# Altium project 499H_VOL_DEV_V1.PrjPcb (part 2 of 2)

## Sheet 31_STM32.SchDoc
size A4; SheetNumber: 7; SheetTotal: 11
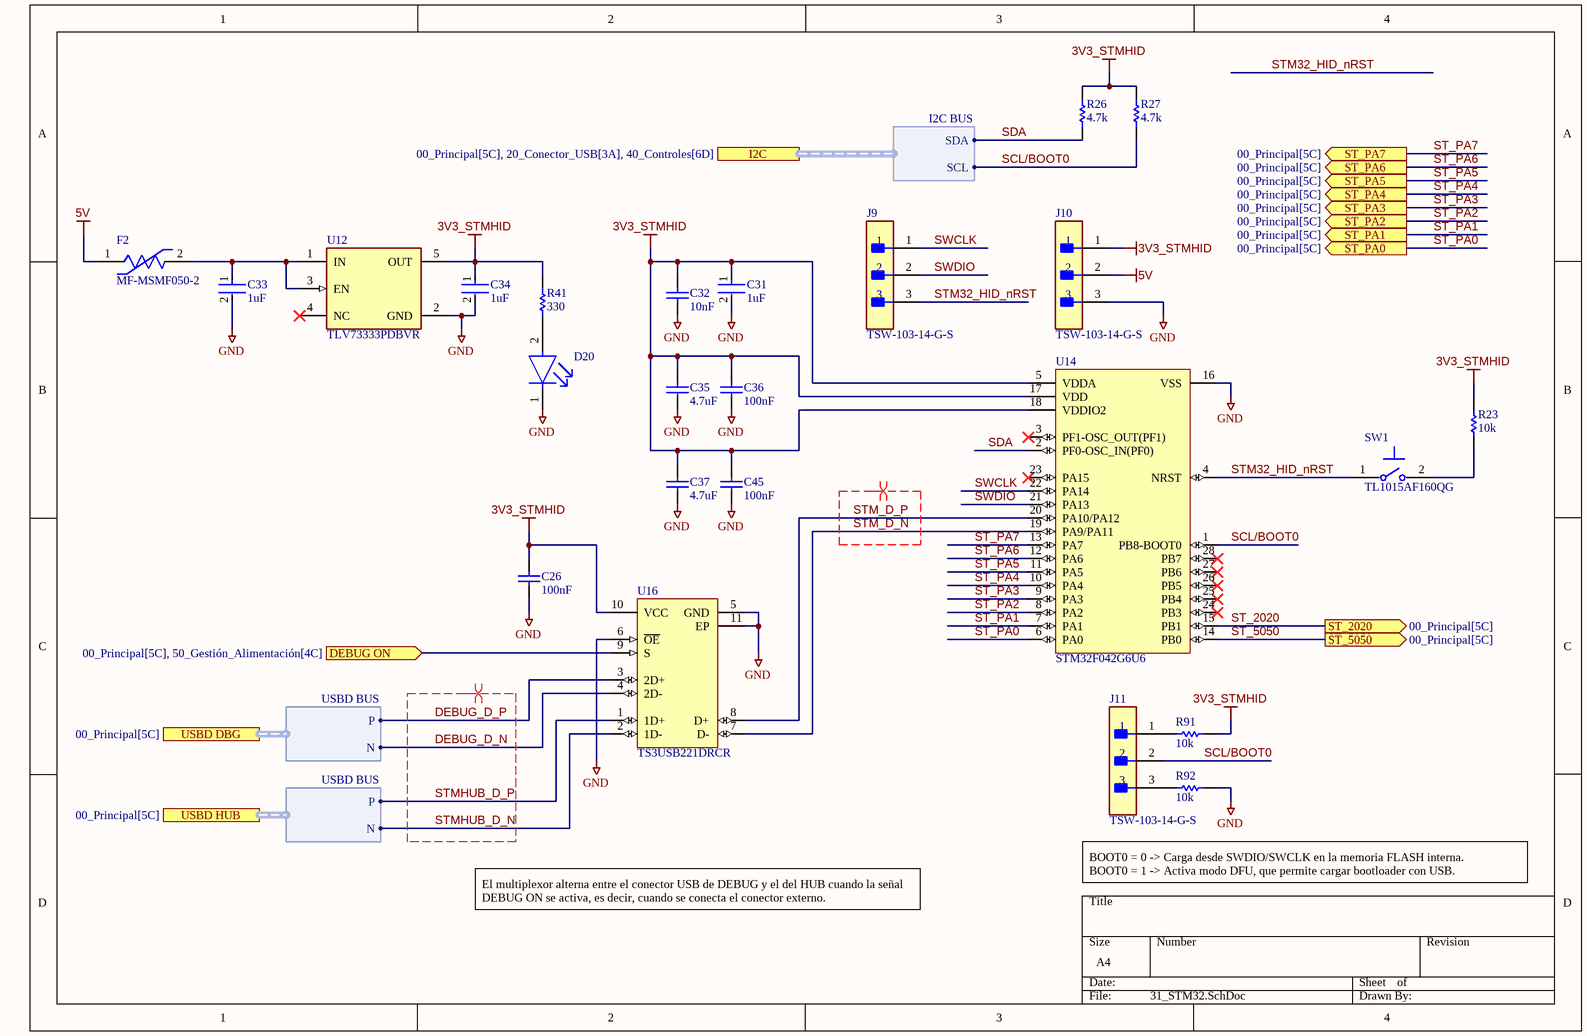
[diagram p6: 31_STM32.SchDoc]

### Parts
C26  100nF  [CAPC1005X55X25NL05T05]
C31  1uF  [FP-C0402C-BB-IPC_B]
C32  10nF  [CAPC1005X55X25ML05T05]
C33  1uF  [FP-C0402C-BB-IPC_B]
C34  1uF  [FP-C0402C-BB-IPC_B]
C35  4.7uF  [CAPC1005X71X25NL10T15]
C36  100nF  [CAPC1005X55X25NL05T05]
C37  4.7uF  [CAPC1005X71X25NL10T15]
C45  100nF  [CAPC1005X55X25NL05T05]
D20  APHD1608LZGCK  [FP-APHD1608LZGCK-MFG]  (value not drawn)
F2  MF-MSMF050-2  [FP-MF-MSMF050-2-MFG]
J9  TSW-103-14-G-S  [FP-TSW-103-14-G-S-MFG]
J10  TSW-103-14-G-S  [FP-TSW-103-14-G-S-MFG]
J11  TSW-103-14-G-S  [FP-TSW-103-14-G-S-MFG]
R23  10k  [RESC1005X40X25ML05T05]
R26  4.7k  [RESC1005X40X25ML05T10]
R27  4.7k  [RESC1005X40X25ML05T10]
R41  330  [RESC1005X40X25NL10T10]
R91  10k  [RESC1005X40X25ML05T05]
R92  10k  [RESC1005X40X25ML05T05]
SW1  TL1015AF160QG  [FP-TL1015AF160QG-MFG]
U12  TLV73333PDBVR  [FP-DBV0005A-MFG]
U14  STM32F042G6U6  [STM-UFQFPN28_V]
U16  TS3USB221DRCR  [DRC0010J_V]

### Ports
DEBUG ON (in, see 00_Principal[5C], 50_Gestión_Alimentación[4C]), I2C (harness I2C BUS, see 00_Principal[5C], 20_Conector_USB[3A], 40_Controles[6D]), ST_2020 (out, see 00_Principal[5C]), ST_5050 (out, see 00_Principal[5C]), ST_PA0 (out, see 00_Principal[5C]), ST_PA1 (out, see 00_Principal[5C]), ST_PA2 (out, see 00_Principal[5C]), ST_PA3 (out, see 00_Principal[5C]), ST_PA4 (out, see 00_Principal[5C]), ST_PA5 (out, see 00_Principal[5C]), ST_PA6 (out, see 00_Principal[5C]), ST_PA7 (out, see 00_Principal[5C]), USBD DBG (harness USBD BUS, see 00_Principal[5C]), USBD HUB (harness USBD BUS, see 00_Principal[5C])

### Harnesses
USBD BUS: P, N
I2C BUS: SDA, SCL

### Nets
3V3_STMHID: C26.2 C31.1 C32.2 C34.1 C35.2 C36.2 C37.2 C45.2 J10.1 R23.2 R26.2 R27.2 R41.2 R91.1 U12.5(OUT) U14.5(VDDA) U14.17(VDD) U14.18(VDDIO2) U16.10(VCC)
5V: F2.1 J10.2
GND: C26.1 C31.2 C32.1 C33.2 C34.2 C35.1 C36.1 C37.1 C45.1 D20.1(C) J10.3 R92.1 U12.2(GND) U14.16(VSS) U16.5(GND) U16.6(~{OE}) U16.11(EP)
DEBUG ON: U16.9(S) ; port DEBUG ON
DEBUG_D_N: U16.4(2D-)
DEBUG_D_P: U16.3(2D+) ; port USBD DBG.P
SCL/BOOT0: J11.2 R27.1 U14.1(PB8-BOOT0) ; port I2C.SCL  [project net SCL]
SDA: R26.1 U14.2(PF0-OSC_IN(PF0)) ; port I2C.SDA
ST_2020: U14.15(PB1) ; port ST_2020
ST_5050: U14.14(PB0) ; port ST_5050
ST_PA0: U14.6(PA0) ; port ST_PA0  [project net LRS PG]
ST_PA1: U14.7(PA1) ; port ST_PA1
ST_PA2: U14.8(PA2) ; port ST_PA2  [project net HUB_RESET]
ST_PA3: U14.9(PA3) ; port ST_PA3
ST_PA4: U14.10(PA4) ; port ST_PA4  [project net IMON]
ST_PA5: U14.11(PA5) ; port ST_PA5
ST_PA6: U14.12(PA6) ; port ST_PA6
ST_PA7: U14.13(PA7) ; port ST_PA7
STM32_HID_nRST: J9.3 SW1.1 U14.4(NRST)
STM_D_N: U14.19(PA9/PA11) U16.7(D-)
STM_D_P: U14.20(PA10/PA12) U16.8(D+)
STMHUB_D_N: U16.2(1D-)
STMHUB_D_P: U16.1(1D+) ; port USBD HUB.P
SWCLK: J9.1 U14.22(PA14)
SWDIO: J9.2 U14.21(PA13)
NetC33_1: C33.1 F2.2 U12.1(IN) U12.3(EN)
NetD20_2: D20.2(A) R41.1
NetJ11_1: J11.1 R91.2
NetJ11_3: J11.3 R92.2
NetR23_1: R23.1 SW1.2

Not connected (* = marked no-connect by the designer): U12 4(NC)*; U14 3(PF1-OSC_OUT(PF1))* 23(PA15)* 24(PB3)* 25(PB4)* 26(PB5)* 27(PB6)* 28(PB7)*

### Layout directives
differential pair; rule Differential Pairs Routing [Pref Gap = 5mil    Min Gap  = 5mil    Max Gap  = 5milPref Width = 8.655mil    Min Width  = 8.655mil    Max Width  = 8.655mil]: DEBUG_D_N, DEBUG_D_P, STM_D_N, STM_D_P, STMHUB_D_N, STMHUB_D_P

### Notes on the sheet
- El multiplexor alterna entre el conector USB de DEBUG y el del HUB cuando la señal DEBUG ON se activa, es decir, cuando se conecta el conector externo.
- BOOT0 = 0 -> Carga desde SWDIO/SWCLK en la memoria FLASH interna.
  BOOT0 = 1 -> Activa modo DFU, que permite cargar bootloader con USB.

### Library data of the parts
C26 C36 C45 = CMP-2008-02030-1: as C4 on sheet 20_Conector_USB
C31 C33 C34 = CMP-03020-034679-1: CAP CER 1UF 16V X5R 0402; Dielectric Material: Ceramic; Tolerance: 10%; RoHS Compliant: Yes; Voltage Rating (DC): 16V; Voltage Rating: 16V; Max Operating Temperature: 85°C; Packaging: Cut Tape; Width: 0.02inch; Dielectric: X5R; Lead Free: Lead Free; Min Operating Temperature: -55°C; Mount: Surface Mount; Case/Package: 0402; Thickness: 0.022inch; REACH SVHC: No SVHC; Length: 0.039inch; Case Code (Metric): 1005; Case Code (Imperial): 0402; Capacitance: 1uF
C32 = CMP-2008-02027-1: Part Number: VJ0402Y103KXJCW1BC; Manufacturer: Vitramon
C35 C37 = CMP-2008-02043-1: Part Number: 0402ZD475MAT2A; Manufacturer: AVX Interconnect / Elco
D20 = CMP-44529-000045-1: LED GREEN CLEAR 1608 SMD; Test Current: 2mA; Dominant Wavelength: 525nm; Lens Color: Colorless; Luminous Intensity: 180mcd; Viewing Angle: 100°; Forward Voltage: 2.65V; Lens Size: 0.7mm; Lens Style: Round; Mount: Surface Mount; Packaging: Tape and Reel; Lens Transparency: Clear; Height: 0.75mm; Case/Package: 0603; Length: 1.6mm; Case Code (Metric): 1608; Width: 0.8mm; Color: Green; Case Code (Imperial): 0603
F2 = CMP-2100-03653-2: PTC RESET FUSE 15V 500MA 1812; Manufacturer: Bourns; Value: 0.15-1Ω; Trip Current: 1A; Automotive Grade: Grade 3; Trip Time: 0.15s; Current Rating: 100A; Hold Current: 0.5A; Height: 0.85mm; Package: 1812; Voltage Rating: 15V; Temperature Range High: +85°C; Device Class L2: PTC Resettable Fuses; Lead Free: Yes; ComponentLink2URL: http://www.bourns.com/docs/Product-Datasheets/mfmsmf.pdf; Ambient Temperature Range High: +85°C; Mouser Description: PTC Resettable Fuse 0.5A(hold) 1A(trip) 15V 100A 0.8W 0.15s 0.15Ohm SMD Solder Pad 1812 T/R; Digikey Description: PTC RESET FUSE 15V 500MA 1812; Manufacturer Part Number: MF-MSMF050-2; Resistance: 0.15-1Ω; Category: Fuse; ComponentLink2Description: Datasheet; Automotive: Yes; Temperature Range Low: -40°C; RoHS: TRUE; Device Class L1: Circuit Protection; Temperature: -40°C to +85°C; Octopart: https://octopart.com/mf-msmf050-2-bourns-28047; Ambient Temperature Range Low: -40°C; Device Class L3: unset
J9-J11 = CMP-02766-001743-1: CONN HEADER VERT 3POS 2.54MM; Max Voltage Rating (AC): 550V; Number of Positions: 3; Max Current Rating: 7.6A; Gender: Male; Termination: Solder; RoHS Compliant: Yes; Mount: Through Hole; Lead Free: Lead Free; Connector Type: Header; REACH SVHC: No SVHC; Insulation Color: Black; Width: 2.54mm; Length: 7.62mm; Flammability Rating: UL94 V-0; Housing Material: Polyester; Contact Material: Bronze; Max Operating Temperature: 125°C; Fastening Type: Pull; Series: TSW; Number of Contacts: 3; Packaging: Bulk; Min Operating Temperature: -55°C; Package Quantity: 1; Height: 10.67mm; Pitch: 2.54mm; Contact Finish - Mating: GOLD; Contact Type: Male Pin; Radiation Hardening: No; Color: Black; Housing Color: Black; Contact Plating: Gold; Orientation: Straight; Number of Rows: 1; Depth: 2.54mm; Insulation Material: PBT; Contact Mating Length: 0.32inch; Contact Shape: Square
R23 R91 R92 = CMP-2002-00601-1: as R4 on sheet 10_Alimentacion_Externa
R26 R27 = CMP-2002-06456-1: as R32 on sheet 20_Conector_USB
R41 = CMP-2002-05883-1: Manufacturer: Panasonic; Part Number: ERA2AEB331X
SW1 = CMP-17879-000003-1: SWITCH TACTILE SPST-NO 0.05A 12V; Actuator Type: Standard; Actuator Length: 0.5mm; Contact Current Rating: 50mA; Mechanical Life: 200000Cycles; Switch Function: Off-Mom; Switch Travel: 0.2mm; Illumination Type: Non-Illuminated; Operating Force: 160gf; Actuator Material: Nylon; Electrical Life: 50000Cycles; Throw Configuration: SPST; Contact Resistance: 100mR; Orientation: Straight; Max Voltage Rating (DC): 12V; Max Operating Temperature: 70°C; Package Quantity: 1; Contact Material: Silver; Packaging: Tape and Reel; Mount: Surface Mount; Color: Beige; Termination: Gull Wing; Case/Package: SMD/SMT; Voltage Rating (DC): 12V; Contact Plating: Silver; REACH SVHC: No SVHC; Min Operating Temperature: -20°C; Current Rating: 50mA; Lead Free: Lead Free
U12 = CMP-04917-000053-1: IC REG LINEAR 3.3V 300MA SOT23-5; Manufacturer: Texas Instruments; Max Junction Temp: +125°C; Accuracy Percentage: 1%; Min Supply Voltage: 1.4V; Number Of Outputs: 1; Dropout Voltage: 125mV; Nominal Supply Current: 34uA; Max Supply Voltage: 5.5V; Output Type: Fixed; Standoff Height: 0mm; Digikey Description: IC REG LINEAR 3.3V 300MA SOT23-5; Manufacturer Part Number: TLV73333PDBVR; Temperature Range High: +125°C; Temperature: -40°C to +125°C; Output Current: 300mA; Mouser Description: LDO Voltage Regulators Capacitr-Free 300-mA 5-SOT-23 -40 to 125; Automotive: No; Height: 1.45mm; Device Class L3: Voltage Regulators - Linear; ComponentLink2Description: Datasheet; Device Class L1: Integrated Circuits (ICs); ComponentLink2URL: http://www.ti.com/lit/ds/symlink/tlv733p.pdf; Octopart: https://octopart.com/tlv73333pdbvr-texas+instruments-51080890; Temperature Range Low: -40°C; RoHS: TRUE; Lead Free: Yes; Output Voltage: 3.3V; Package: DBV0005A; Device Class L2: Power Management ICs; Category: IC
U14 = CMP-0304-00112-2: ARM Cortex-M0 32-bit MCU, 32 KB Flash, 6 KB Internal RAM, 24 I/Os, 28-Pin UFQFPN, -40 to 85 degC, Tray; Manufacturer: STMicroelectronics; FLASH Size (Prog) (kB): 32; I/Os (High Current): 24; Internal RAM Size (kB): 6; Supply Voltage(Vcc) min (V): 2; Operating Frequency(F) (Processor speed) (MHz): 48; Core: ARM Cortex-M0; PartNumber: STM32F042G6U6; Packing: Tray; Package Description: 28-Pin Ultra Thin Fine Pitch Quad Flat No-Lead, 4 x 4 x 0.6 mm Body, 0.5 mm Pitch; ComponentLink2Description: Datasheet; ComponentLink1Description: Manufacturer URL; Package Reference: UFQFPN28; DatasheetVersion: Rev. 5; ComponentLink1URL: http://www.st.com/; ComponentLink2URL: http://www.st.com/st-web-ui/static/active/en/resource/technical/document/datasheet/DM00105814.pdf; Mounting Technology: Surface Mount
U16 = CMP-0309-00084-2: High-Speed USB 2.0 (480 Mbps) 1:2 Multiplexer / Demultiplexer Switch with Single Enable, 6 ohm RON, 2.5 to 3.3V, -40 to 85 degC, 10-Pin SON (DRC), Green (RoHS & no Sb/Br); Manufacturer: Texas Instruments; Number of Channels: 2; ON Time(Max)(ns): 30; SubFamily: USB Switch; RON Mis-match(Max)(Ohms): 0.2; Vcc range(V): 2.3 to 3.6; tpd max(ns): 0.25; OFF Time(Max)(ns): 12; ron(max)(ohms): 6; ESD HBM(kV): +/-2; Architecture: "1","2 mux/demux"; RON Flatness(Max)(Ohms): 1; Bandwidth(MHz): 1200; IL OFF(Max)(nA): 2; PackageVersion: revL, Sep-2011; Mounting Technology: Surface Mount; ICC(uA): 30; DatasheetVersion: SCDS220G; PartNumber: TS3USB221DRCR; Charge Injection(Max)(pC): N/A; ComponentLink1Description: Datasheet; PackageDescription: 10-Pin Plastic Small Outline No-Lead, 3 x 3 x 1 mm Body, 0.5 mm Pitch, Exposed Pad; ComponentLink2URL: http://www.ti.com/litv/pdf/mpds117k; Eco-Plan: Green (RoHS & no Sb/Br); ComponentLink2Description: Package Specification; ComponentLink1URL: http://www.ti.com/general/docs/lit/getliterature.tsp?genericPartNumber=TS3USB221&fileType=pdf; PackageReference: DRC0010J

## Sheet 30_ATMega32u4.SchDoc
size A4; SheetNumber: 6; SheetTotal: 11
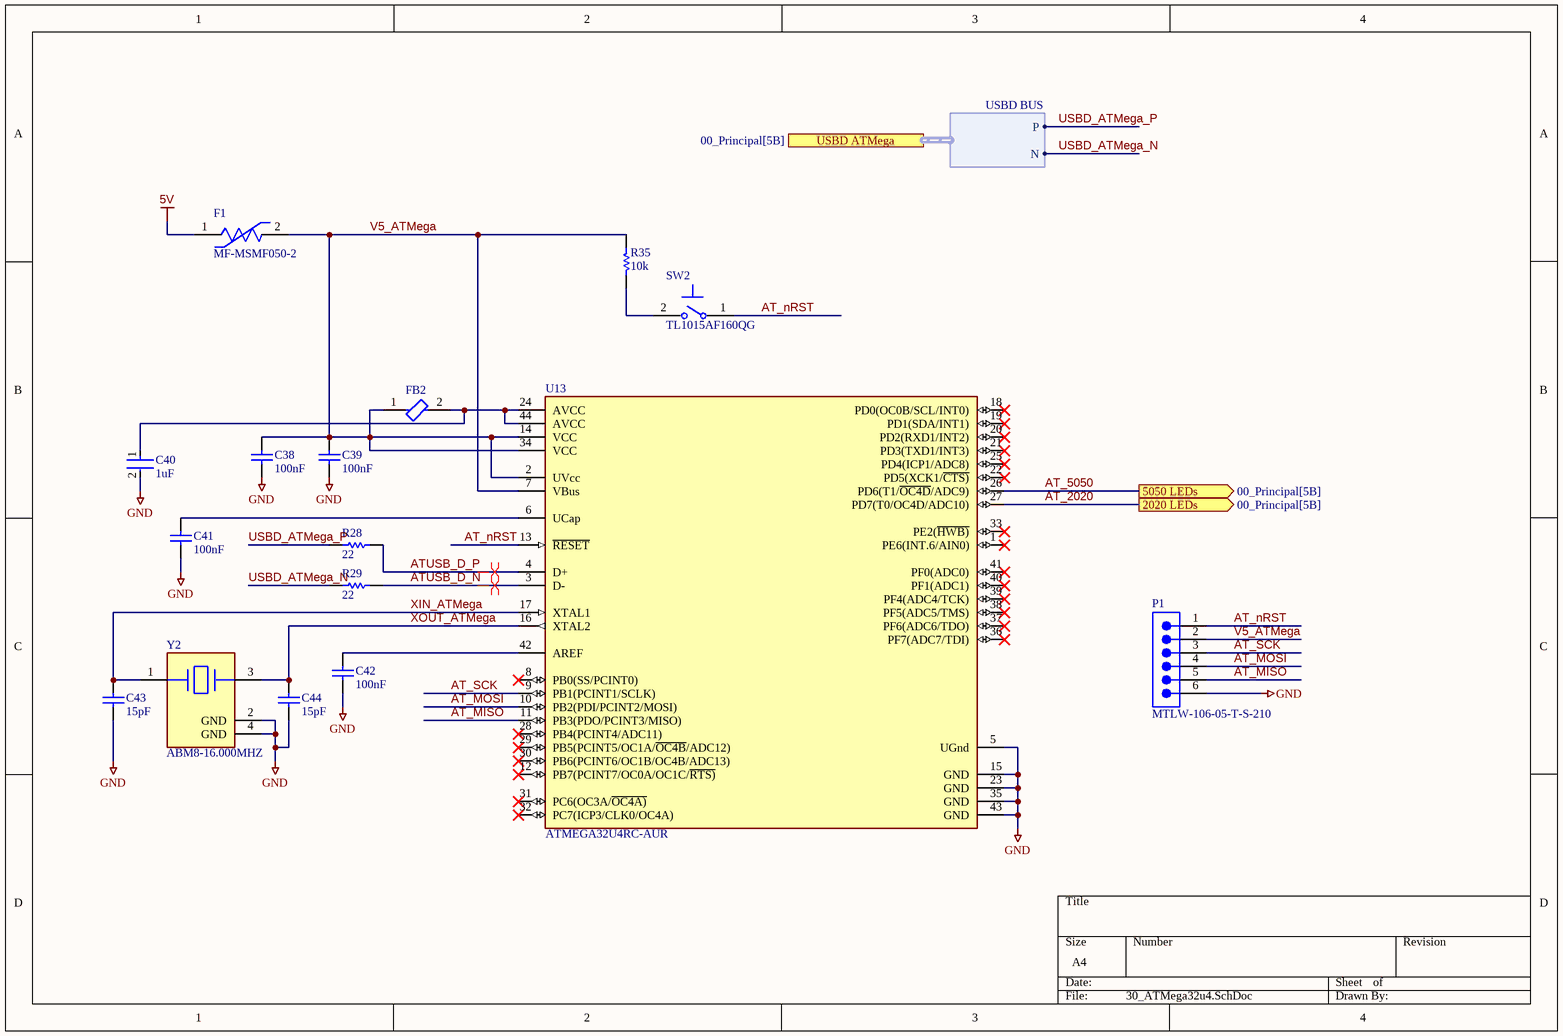
[diagram p7: 30_ATMega32u4.SchDoc]

### Parts
C38  100nF  [CAPC1005X55X25NL05T05]
C39  100nF  [CAPC1005X55X25NL05T05]
C40  1uF  [FP-C0402C-BB-IPC_B]
C41  100nF  [CAPC1005X55X25NL05T05]
C42  100nF  [CAPC1005X55X25NL05T05]
C43  15pF  [CAPC1005X56X25NL10T15]
C44  15pF  [CAPC1005X56X25NL10T15]
F1  MF-MSMF050-2  [FP-MF-MSMF050-2-MFG]
FB2  MH2029-300Y  [FP-MH2029-MFG]  (value not drawn)
P1  MTLW-106-05-T-S-210  [SMTC-MTLW-106-05-X-S-210]
R28  22  [RESC1005X40X25NL05T05]
R29  22  [RESC1005X40X25NL05T05]
R35  10k  [RESC1005X40X25NL05T05]
SW2  TL1015AF160QG  [FP-TL1015AF160QG-MFG]
U13  ATMEGA32U4RC-AUR  [FP-ML-MFG]
Y2  ABM8-16.000MHZ  [FP-ABM8-MFG]

### Ports
2020 LEDs (out, see 00_Principal[5B]), 5050 LEDs (out, see 00_Principal[5B]), USBD ATMega (harness USBD BUS, see 00_Principal[5B])

### Harnesses
USBD BUS: P, N

### Nets
5V: F1.1
GND: C38.1 C39.1 C40.2 C41.1 C42.1 C43.1 C44.1 P1.6 U13.5(UGnd) U13.15(GND) U13.23(GND) U13.35(GND) U13.43(GND) Y2.2(GND) Y2.4(GND)
AT_2020: U13.27(PD7(T0/OC4D/ADC10)) ; port 2020 LEDs
AT_5050: U13.26(PD6(T1/~{OC4D}/ADC9)) ; port 5050 LEDs
AT_MISO: P1.5 U13.11(PB3(PDO/PCINT3/MISO))
AT_MOSI: P1.4 U13.10(PB2(PDI/PCINT2/MOSI))
AT_nRST: P1.1 SW2.1 U13.13(~{RESET})
AT_SCK: P1.3 U13.9(PB1(PCINT1/SCLK))
ATUSB_D_N: R29.2 U13.3(D-)
ATUSB_D_P: R28.2 U13.4(D+)
USBD_ATMega_N: R29.1 ; port USBD ATMega.N
USBD_ATMega_P: R28.1 ; port USBD ATMega.P
V5_ATMega: C38.2 C39.2 F1.2 FB2.1 P1.2 R35.2 U13.2(UVcc) U13.7(VBus) U13.14(VCC) U13.34(VCC)
XIN_ATMega: C43.2 U13.17(XTAL1) Y2.1
XOUT_ATMega: C44.2 U13.16(XTAL2) Y2.3
NetC40_1: C40.1 FB2.2 U13.24(AVCC) U13.44(AVCC)
NetC41_2: C41.2 U13.6(UCap)
NetC42_2: C42.2 U13.42(AREF)
NetR35_1: R35.1 SW2.2

Not connected (* = marked no-connect by the designer): U13 1(PE6(INT.6/AIN0))* 8(PB0(SS/PCINT0))* 12(PB7(PCINT7/OC0A/OC1C/~{RTS)})* 18(PD0(OC0B/SCL/INT0))* 19(PD1(SDA/INT1))* 20(PD2(RXD1/INT2))* 21(PD3(TXD1/INT3))* 22(PD5(XCK1/~{CTS)})* 25(PD4(ICP1/ADC8))* 28(PB4(PCINT4/ADC11))* 29(PB5(PCINT5/OC1A/~{OC4B}/ADC12))* 30(PB6(PCINT6/OC1B/OC4B/ADC13))* 31(PC6(OC3A/~{OC4A)})* 32(PC7(ICP3/CLK0/OC4A))* 33(PE2(~{HWB)})* 36(PF7(ADC7/TDI))* 37(PF6(ADC6/TDO))* 38(PF5(ADC5/TMS))* 39(PF4(ADC4/TCK))* 40(PF1(ADC1))* 41(PF0(ADC0))*

### Layout directives
differential pair; rule Differential Pairs Routing [Pref Gap = 5mil    Min Gap  = 5mil    Max Gap  = 5milPref Width = 8.655mil    Min Width  = 8.655mil    Max Width  = 8.655mil]: ATUSB_D_N, ATUSB_D_P

### Library data of the parts
C38 C39 C41 C42 = CMP-2008-02030-1: as C4 on sheet 20_Conector_USB
C40 = CMP-03020-034679-1: as C31 on sheet 31_STM32; RoHS Compliant: Yes; Voltage Rating (DC): 16V; Voltage Rating: 16V; Max Operating Temperature: 85°C; Packaging: Cut Tape; Width: 0.02inch; Dielectric: X5R; Lead Free: Lead Free; Min Operating Temperature: -55°C; Mount: Surface Mount; Case/Package: 0402; Thickness: 0.022inch; REACH SVHC: No SVHC; Length: 0.039inch; Case Code (Metric): 1005; Case Code (Imperial): 0402; Capacitance: 1uF
C43 C44 = CMP-2008-02762-1: Manufacturer: AVX Interconnect / Elco; Part Number: 0402YA150JAT2A
F1 = CMP-2100-03653-2: as F2 on sheet 31_STM32; Height: 0.85mm; Package: 1812; Voltage Rating: 15V; Temperature Range High: +85°C; Device Class L2: PTC Resettable Fuses; Lead Free: Yes; ComponentLink2URL: http://www.bourns.com/docs/Product-Datasheets/mfmsmf.pdf; Ambient Temperature Range High: +85°C; Mouser Description: PTC Resettable Fuse 0.5A(hold) 1A(trip) 15V 100A 0.8W 0.15s 0.15Ohm SMD Solder Pad 1812 T/R; Digikey Description: PTC RESET FUSE 15V 500MA 1812; Manufacturer Part Number: MF-MSMF050-2; Resistance: 0.15-1Ω; Category: Fuse; ComponentLink2Description: Datasheet; Automotive: Yes; Temperature Range Low: -40°C; RoHS: TRUE; Device Class L1: Circuit Protection; Temperature: -40°C to +85°C; Octopart: https://octopart.com/mf-msmf050-2-bourns-28047; Ambient Temperature Range Low: -40°C; Device Class L3: unset
FB2 = CMP-07252-000001-1: FERRITE BEAD 30 OHM 0805 1LN; Manufacturer: Bourns; Series Resistance: 25mΩ; Resistance: 30Ω; Value: 30Ω; Impedance At Frequency: 30Ω @ 100MHz; Rms Current: 3A; Tolerance: 25%; RoHS: TRUE; Manufacturer Part Number: MH2029-300Y; Temperature Range High: +125°C; Device Class L3: Ferrite Beads and Chips; Core Material: Ferrite; ComponentLink2Description: Datasheet; Category: FBead; Octopart: https://octopart.com/mh2029-300y-bourns-756929; Digikey Description: FERRITE BEAD 30 OHM 0805 1LN; Device Class L2: EMI / RFI Components; Lead Free: Yes; Mouser Description: Ferrite Beads 30 ohms 25% HIGH CURRENT; Automotive: No; Ipc Land Pattern Name: CAPC200120X90; Temperature: -55°C to +125°C; Device Class L1: Passive Components; Height: 1.1mm; ComponentLink2URL: https://www.bourns.com/docs/Product-Datasheets/mh.pdf; Package: MH2029; Temperature Range Low: -55°C
P1 = CMP-1024-00082-1: Low Profile .025" SQ Post Header, Through-hole, Vertical, -55 to 105 degC, 2.54 mm Pitch, 6-Pin, Male, RoHS; Manufacturer: Samtec; Pitch: 2.54 mm; ComponentLink1Description: Manufacturer URL; ComponentLink2URL: http://www.samtec.com/documents/webfiles/pdf/MTLW_TH.PDF; RoHS: True; DatasheetVersion: F-214; PackageVersion: T, 6/1991; ComponentLink3URL: http://www.samtec.com/documents/webfiles/cpdf/MTLW-1XX-XX-XX-X-XXX-XX-XX-MKT1.pdf; Temperature Range: -55 to 105 degC; Orientation: Vertical; PartNumber: MTLW-106-05-T-S-210; ComponentLink2Description: Datasheet; PackageDescription: Low Profile Terminal Assembly; Mounting Technology: Through-hole; ComponentLink1URL: http://www.samtec.com; ComponentLink3Description: Package Specification; PackageReference: MTLW-106-05-X-S-210
R28 R29 = CMP-2002-01135-4: Chip Resistor, 22 Ohm, +/- 1%, 0.1 W, -55 to 155 degC, 0402 (1005 Metric), RoHS, Tape and Reel; PartNumber: ERJ-2RKF22R0X; Case\/Package: 0402; Resistance: 22 Ohm; Power Rating: 100 mW; Voltage Rating: 50 V; ComponentLink2Description: Datasheet; Packaging: Tape and Reel; Weight: 2.8E-05oz; Pins: 2; Case Code (Imperial): 0402; Width: 0.5 mm; ComponentLink2URL: http://industrial.panasonic.com/cdbs/www-data/pdf/RDA0000/AOA0000C86.pdf; Height: 0.35 mm; PackageReference: 0402; REACH SVHC: Yes; Min Operating Temperature: -55 degC; Length: 1 mm; DatasheetVersion: 04/2015; RoHSCompliant: true; Package Quantity: 10000; Case Code (Metric): 1005; PackageDescription: 2-Pin Surface Mount Device, Body 1 x 0.5 mm; ComponentLink1URL: http://www.panasonic.com/; Mount: Surface Mount; Mounting Technology: Surface Mount; Tolerance: 1%; Max Operating Temperature: 155 degC; ComponentLink1Description: Manufacturer URL
R35 = CMP-2002-00601-1: as R4 on sheet 10_Alimentacion_Externa
SW2 = CMP-17879-000003-1: as SW1 on sheet 31_STM32; Orientation: Straight; Max Voltage Rating (DC): 12V; Max Operating Temperature: 70°C; Package Quantity: 1; Contact Material: Silver; Packaging: Tape and Reel; Mount: Surface Mount; Color: Beige; Termination: Gull Wing; Case/Package: SMD/SMT; Voltage Rating (DC): 12V; Contact Plating: Silver; REACH SVHC: No SVHC; Min Operating Temperature: -20°C; Current Rating: 50mA; Lead Free: Lead Free
U13 = CMP-06276-000452-1: IC MCU 8BIT 32KB FLASH 44TQFP; Number of Timers/Counters: 4; Min Supply Voltage: 2.7V; Number of I/Os: 26; Data Bus Width: 8b; Interface: I2C; Max Frequency: 16MHz; RAM Size: 2.5KB; Peripherals: Brown-out Detect/Reset; Oscillator Type: Internal; Core Architecture: AVR; Max Supply Voltage: 5.5V; Series: AVR® ATmega; Min Operating Temperature: -40°C; Number of Pins: 44; Memory Type: FLASH; Frequency: 16MHz; Mount: Surface Mount; Case/Package: TQFP; Packaging: Tape and Reel; Memory Size: 32KB; Package Quantity: 1500; Max Operating Temperature: 85°C
Y2 = CMP-27762-003067-1: Crystal 16MHz ±20ppm 18pF SMD-4 3.2mm x 2.5mm; Frequency Stability: 50ppm; ESR (Equivalent Series Resistance): 70R; Packaging: Tape and Reel; Load Capacitance: 18pF; Min Operating Temperature: -20°C; Case/Package: SMD/SMT; Length: 0.126inch; RoHS Compliant: Yes; Max Operating Temperature: 70°C; Width: 0.098inch; Series: ABM8; Frequency: 16MHz; Height: 0.031inch; Mount: Surface Mount; Frequency Tolerance: 20ppm

## Sheet 33_USB_VoCore.SchDoc
size A; SheetNumber: 7; SheetTotal: 11
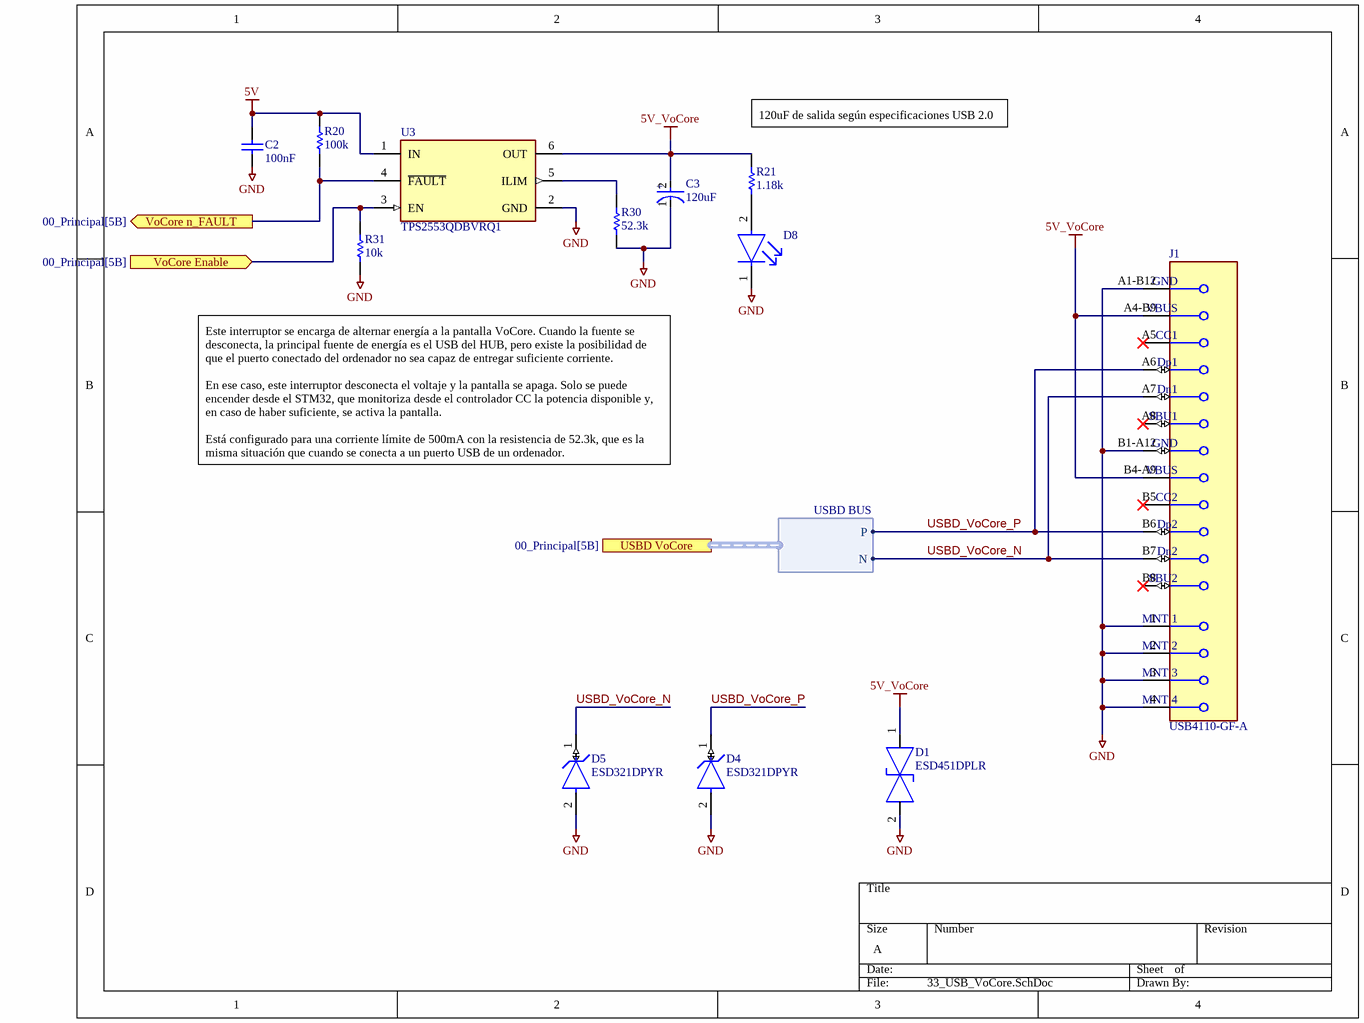
[diagram p8: 33_USB_VoCore.SchDoc]

### Parts
C2  100nF  [CAPC1005X55X25NL05T05]
C3  120uF  [FP-OS-CON-SMT-E7-MFG]
D1  ESD451DPLR  [FP-DPL0002A_MFG]
D4  ESD321DPYR  [FP-DPY0002A-MFG]
D5  ESD321DPYR  [FP-DPY0002A-MFG]
D8  APHD1608LZGCK  [FP-APHD1608LZGCK-MFG]  (value not drawn)
J1  USB4110-GF-A  [FP-USB4110-GF-A-MFG]
R20  100k  [RESC1005X40X25LL05T05]
R21  1.18k  [RESC1005X40X25NL05T05]
R30  52.3k  [RESC1005X40X25LL05T05]
R31  10k  [RESC1005X40X25ML05T05]
U3  TPS2553QDBVRQ1  [FP-DBV0006A-IPC_A]

### Ports
USBD VoCore (harness USBD BUS, see 00_Principal[5B]), VoCore Enable (in, see 00_Principal[5B]), VoCore n_FAULT (out, see 00_Principal[5B])

### Harnesses
USBD BUS: P, N

### Nets
5V: C2.2 R20.2 U3.1(IN)
5V_VoCore: C3.2(A) D1.1(1_IO) J1.A4-B9(VBUS) J1.B4-A9(VBUS) R21.2 U3.6(OUT)
GND: C2.1 C3.1(C) D1.2(2_IO) D4.2(GND) D5.2(GND) D8.1(C) J1.1(MNT_1) J1.2(MNT_2) J1.3(MNT_3) J1.4(MNT_4) J1.A1-B12(GND) J1.B1-A12(GND) R30.1 R31.1 U3.2(GND)
ST_PA6: R31.2 U3.3(EN) ; port VoCore Enable
ST_PA7: R20.1 U3.4(~{FAULT}) ; port VoCore n_FAULT
USBD_VoCore_N: D5.1(IO) J1.A7(Dn1) J1.B7(Dn2) ; port USBD VoCore.N
USBD_VoCore_P: D4.1(IO) J1.A6(Dp1) J1.B6(Dp2) ; port USBD VoCore.P
NetD8_2: D8.2(A) R21.1
NetR30_2: R30.2 U3.5(ILIM)

Not connected (* = marked no-connect by the designer): J1 A5(CC1)* A8(SBU1)* B5(CC2)* B8(SBU2)*

### Notes on the sheet
- (near R21) 120uF de salida según especificaciones USB 2.0
- Este interruptor se encarga de alternar energía a la pantalla VoCore. Cuando la fuente se desconecta, la principal fuente de energía es el USB del HUB, pero existe la posibilidad de que el puerto conectado del ordenador no sea capaz de entregar suficiente corriente.
  En ese caso, este interruptor desconecta el voltaje y la pantalla se apaga. Solo se puede encender desde el STM32, que monitoriza desde el controlador CC la potencia disponible y, en caso de haber suficiente, se activa la pantalla.
  Está configurado para una corriente límite de 500mA con la resistencia de 52.3k, que es la misma situación que cuando se conecta a un puerto USB de un ordenador.
- (in symbol CMP-05428-000660-1) +

### Library data of the parts
C2 = CMP-2008-02030-1: as C4 on sheet 20_Conector_USB
C3 = CMP-05428-000660-1: Conductive Polymer Aluminum Solid Capacitors (OS-CON) 120uF ±20% 10V RADIAL SMT 8x6.9mm; Dissipation Factor: 12%; Polarity: Polar; ESR (Equivalent Series Resistance): 35mR; Ripple Current (AC): 2.56A; Leakage Current: 240uA; Life (Hours): 2000Hour; RoHS Compliant: Yes; Height - Seated (Max): 0.276inch; Tolerance: 20%; REACH SVHC: No SVHC; Series: OS-CON™, SVP; Case/Package: Radial; Package Quantity: 1000; Length: 6.9mm; Voltage: 10V; Max Operating Temperature: 105°C; Construction: Cylindrical; Height: 6.9mm; Material: Polymer; Ripple Current: 2.56A; Diameter: 8mm; Number of Pins: 7; Termination: SMD/SMT; Lead Free: Lead Free; Voltage Rating: 10V; Packaging: Tape and Reel; Min Operating Temperature: -55°C; Capacitance: 120uF; Mount: Surface Mount; Voltage Rating (DC): 10V
D1 = CMP-00370-140306676-1: 0.5-pF, 5.5-V, 30-KV bidirectional ESD protection device in 0201 package 2-X2SON -40 to 125; Manufacturer Lifecycle Status: ACTIVE; Thickness: 300µm; ComponentLink3URL: https://www.ti.com/lit/ds/symlink/tpd1e04u04.pdf?ts=1701165483995&ref_url=https%253A%252F%252Fwww.ti.com%252Fproduct%252FTPD1E04U04%252Fpart-details%252FTPD1E04U04DPLR; ComponentLink3Description: Manufacturer's Package Drawing; Lifecycle Status: Production; ComponentLink1URL: http://ti.com; ComponentLink2Description: HelpURL; Width: 300µm; ComponentLink2URL: https://www.ti.com/lit/ds/symlink/esd451.pdf; Height: 320µm; Number of Pins: 2; ComponentLink1Description: Manufacturer's Website; Length: 600µm
D4 D5 = CMP-04989-000001-1: HDMI2.0 ESD PROTECTION; Manufacturer: Texas Instruments; Standoff Height: 0mm; Peak Pulse Current: 6A; Value: 0.9pF; Number Of Channels: 1; Reverse Standoff Voltage: 3.6V; Peak Pulse Power: 40W; Breakdown Voltage: 4.5V; Direction: Unidirectional; Clamping Voltage: 6.8V; RoHS: TRUE; Temperature: -40°C to +125°C; Package: DPY0002A; Temperature Range Low: -40°C; Temperature Range High: +125°C; Category: Diode; Capacitance: 0.9pF; Ambient Temperature Range Low: -40°C; Device Class L3: unset; Device Class L1: Circuit Protection; Ambient Temperature Range High: +125°C; ComponentLink2URL: http://www.ti.com/lit/ds/symlink/esd321.pdf; Octopart: https://octopart.com/esd321dpyr-texas+instruments-94354200; Manufacturer Part Number: ESD321DPYR; Digikey Description: HDMI2.0 ESD PROTECTION; Lead Free: Yes; ComponentLink2Description: Datasheet; Device Class L2: TVS Diodes; Height: 0.45mm; Automotive: No
D8 = CMP-44529-000045-1: as D20 on sheet 31_STM32; Mount: Surface Mount; Packaging: Tape and Reel; Lens Transparency: Clear; Height: 0.75mm; Case/Package: 0603; Length: 1.6mm; Case Code (Metric): 1608; Width: 0.8mm; Color: Green; Case Code (Imperial): 0603
J1 = CMP-245163-000002-1: CONN USB 2.0 TYPE-C R/A SMT; Manufacturer: GCT; Conn Orientation: Right Angle; Usb Standard: USB 2.0; Voltage Rating: 20V; Current Rating: 3/4.25/1.25/0.25A; Number Of Contacts: 16; Is Female: yes; Shielding: true; Standoff Height: 0.1mm; Octopart: https://octopart.com/usb4110-gf-a-gct-103941985; Temperature: -40°C to +85°C; RoHS: TRUE; Automotive: No; Contact Material: Gold,Nickel; Device Class L1: Connectors; Device Class L2: USB Connectors; Package: 0; Lead Free: Yes; ComponentLink2URL: https://gct.co/files/drawings/usb4110.pdf; Temperature Range High: +85°C; Temperature Range Low: -40°C; Height: 3.46mm; Manufacturer Part Number: USB4110-GF-A; ComponentLink2Description: Datasheet; Device Class L3: unset; Digikey Description: CONN USB 2.0 TYPE-C R/A SMT; Category: Conn
R20 = CMP-2002-00602-1: Manufacturer: Panasonic; Part Number: ERJ-2RHD1003X
R21 = CMP-1011-00517-2: Part Number: ERJ-2RKF1181X; Manufacturer: Panasonic
R30 = CMP-2002-00981-1: Part Number: ERJ-2RKF5232X; Manufacturer: Panasonic
R31 = CMP-2002-00601-1: as R4 on sheet 10_Alimentacion_Externa
U3 = CMP-04913-000016-1: IC PWR SWITCH N-CHAN 1:1 SOT23-6; Number of Outputs: 1; Output Current: 1.5A; Operating Supply Voltage: 6.5V; Turn-On Delay Time: 3ms; Min Input Voltage: 2.5V; Fault Protection: Over Temperature; Output Configuration: High Side; Interface: On/Off; Packaging: Tape and Reel; Lead Free: Lead Free; Min Operating Temperature: -40°C; Number of Pins: 6; Max Supply Current: 1.5A; Mount: Surface Mount; Max Input Voltage: 6.5V; Turn-Off Delay Time: 3ms; RoHS Compliant: Yes; Number of Switches: 1; Max Operating Temperature: 125°C; Package Quantity: 3000; Max Output Current: 1.5A; Series: -; Case/Package: SOT-23-6

## Sheet 41_LEDs.SchDoc
size A4; SheetNumber: 8; SheetTotal: 10
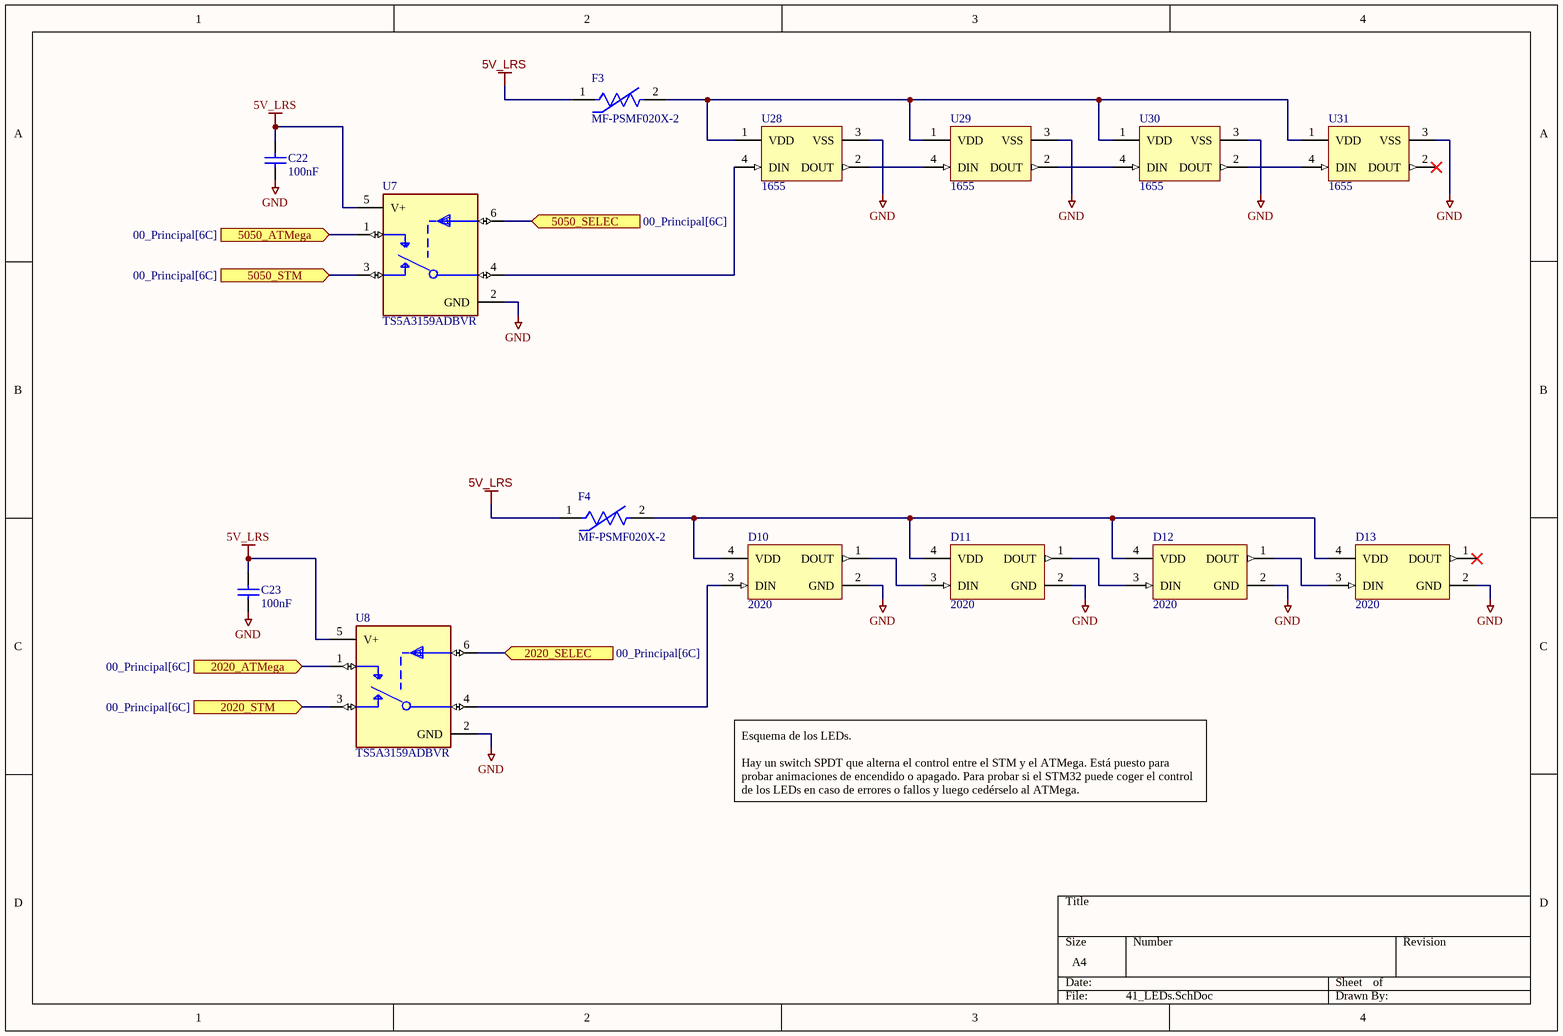
[diagram p9: 41_LEDs.SchDoc]

### Parts
C22  100nF  [CAPC1005X55X25NL05T05]
C23  100nF  [CAPC1005X55X25NL05T05]
D10  2020  [Adafruit 4684]  (no BOM)
D11  2020  [Adafruit 4684]  (no BOM)
D12  2020  [Adafruit 4684]  (no BOM)
D13  2020  [Adafruit 4684]  (no BOM)
F3  MF-PSMF020X-2  [FP-MF-PSMF-MFG]
F4  MF-PSMF020X-2  [FP-MF-PSMF-MFG]
U7  TS5A3159ADBVR  [FP-DBV0006A-MFG]
U8  TS5A3159ADBVR  [FP-DBV0006A-MFG]
U28  1655  [ADA-RGB-1655_V]  (no BOM)
U29  1655  [ADA-RGB-1655_V]  (no BOM)
U30  1655  [ADA-RGB-1655_V]  (no BOM)
U31  1655  [ADA-RGB-1655_V]  (no BOM)

### Ports
2020_ATMega (in, see 00_Principal[6C]), 2020_SELEC (in, see 00_Principal[6C]), 2020_STM (in, see 00_Principal[6C]), 5050_ATMega (in, see 00_Principal[6C]), 5050_SELEC (in, see 00_Principal[6C]), 5050_STM (in, see 00_Principal[6C])

### Nets
5V_LRS: C22.2 C23.2 F3.1 F4.1 U7.5(V+) U8.5(V+)
GND: C22.1 C23.1 D10.2(GND) D11.2(GND) D12.2(GND) D13.2(GND) U7.2(GND) U8.2(GND) U28.3(VSS) U29.3(VSS) U30.3(VSS) U31.3(VSS)
AT_2020: U8.1(NO) ; port 2020_ATMega
AT_5050: U7.1(NO) ; port 5050_ATMega
ST_2020: U8.3(NC) ; port 2020_STM
ST_5050: U7.3(NC) ; port 5050_STM
ST_PA5: U7.6(IN) U8.6(IN) ; port 5050_SELEC, port 2020_SELEC
NetD10_1: D10.1(DOUT) D11.3(DIN)
NetD10_3: D10.3(DIN) U8.4(COM)
NetD10_4: D10.4(VDD) D11.4(VDD) D12.4(VDD) D13.4(VDD) F4.2
NetD11_1: D11.1(DOUT) D12.3(DIN)
NetD12_1: D12.1(DOUT) D13.3(DIN)
NetF3_2: F3.2 U28.1(VDD) U29.1(VDD) U30.1(VDD) U31.1(VDD)
NetU7_4: U7.4(COM) U28.4(DIN)
NetU28_2: U28.2(DOUT) U29.4(DIN)
NetU29_2: U29.2(DOUT) U30.4(DIN)
NetU30_2: U30.2(DOUT) U31.4(DIN)

Not connected (* = marked no-connect by the designer): D13 1(DOUT)*; U31 2(DOUT)*

### Notes on the sheet
- Esquema de los LEDs.
  Hay un switch SPDT que alterna el control entre el STM y el ATMega. Está puesto para probar animaciones de encendido o apagado. Para probar si el STM32 puede coger el control de los LEDs en caso de errores o fallos y luego cedérselo al ATMega.

### Library data of the parts
C22 C23 = CMP-2008-02030-1: as C4 on sheet 20_Conector_USB
D10-D13 = NeoPixel Nano 2020: Adafruit Accessories NeoPixel Nano 2020 RGB LEDs WS2812B; Supplier 1: DigiKey; Supplier Part Number 1: 1528-4684-ND
F3 F4 = CMP-07400-000005-1: PTC RESET FUSE 9V 200MA 0805; Manufacturer: Bourns; Trip Current: 0.5A; Resistance: 0.65-3.5Ω; Current Rating: 40A; Value: 0.65-3.5Ω; Trip Time: 0.02s; Hold Current: 0.2A; ComponentLink2Description: Datasheet; Manufacturer Part Number: MF-PSMF020X-2; Height: 0.85mm; Ambient Temperature Range High: +85°C; Category: Fuse; Temperature Range Low: -40°C; ComponentLink2URL: https://www.bourns.com/docs/Product-Datasheets/mfpsmf.pdf; Temperature Range High: +85°C; RoHS: TRUE; Device Class L1: Circuit Protection; Device Class L3: unset; Package: MF-PSMF; Digikey Description: PTC RESET FUSE 9V 200MA 0805; Mouser Description: PTC Resettable Fuse 0.2A(hold) 0.5A(trip) 9V 40A 0.5W 0.02s 0.65Ohm SMD Solder Pad 0805 T/R; Voltage Rating: 9V; Automotive: No; Device Class L2: PTC Resettable Fuses; Temperature: -40°C to +85°C; Lead Free: Yes; Octopart: https://octopart.com/mf-psmf020x-2-bourns-7483437; Ambient Temperature Range Low: -40°C
U7 U8 = CMP-04892-000011-1: IC SWITCH SPDT SOT23-6; Manufacturer: Texas Instruments; Min Supply Voltage: 1.65V; Nominal Supply Current: 0.01-5uA; Number Of Circuits: 1; Mux Demux Ratio: 2:1; Standoff Height: 0mm; Max Supply Voltage: 5.5V; On State Resistance: 1Ω; Package: DBV0006A; Device Class L3: Analog Switches; Throw Configuration: SPDT; ComponentLink2Description: Datasheet; Digikey Description: IC SWITCH SPDT SOT23-6; Automotive: No; Temperature: -40°C to +85°C; Device Class L2: Interface ICs; Ambient Temperature Range Low: -40°C; Ipc Land Pattern Name: SOT95P280X145-6; ComponentLink2URL: http://www.ti.com/lit/ds/symlink/ts5a3159a.pdf; Octopart: https://octopart.com/ts5a3159adbvr-texas+instruments-443714; Lead Free: Yes; Height: 1.45mm; Temperature Range High: +85°C; Mouser Description: Analog Switch ICs SPDT ANALOG SWITCH; Device Class L1: Integrated Circuits (ICs); Manufacturer Part Number: TS5A3159ADBVR; Category: IC; RoHS: TRUE; Ambient Temperature Range High: +85°C; Temperature Range Low: -40°C
U28-U31 = CMP-2000-05026-1: Intelligent Control LED Integrated Light Source, 3.5 to 5.3 V, -25 to 80 degC, 4-Pin SMD, RoHS, Tape and Reel; Manufacturer: Adafruit-Industries-LLC; Number of LEDs: 10; Configuration: Discrete; Utilized LED: WS2812(5050); Datasheet URL: http://datasheet.octopart.com/ADA1655-Adafruit-Industries-datasheet-32028139.pdf; Series: Neopixel; Interface: -; Package Description: 4-Pin Surface Mount Device, Body 5 x 5 mm; Color: Red,Green,Blue(RGB); Category: Optoelectronics; Controller Type: -; Package Reference: 1655; Manufacturer URL: https://www.adafruit.com/; Mounting Type: SurfaceMount; Datasheet Version: May-13; Size / Dimension: 5.00mmLx5.00mmW; Family: Addressable,Specialty

## Sheet 40_Controles.SchDoc
size A3; SheetNumber: 10; SheetTotal: 11
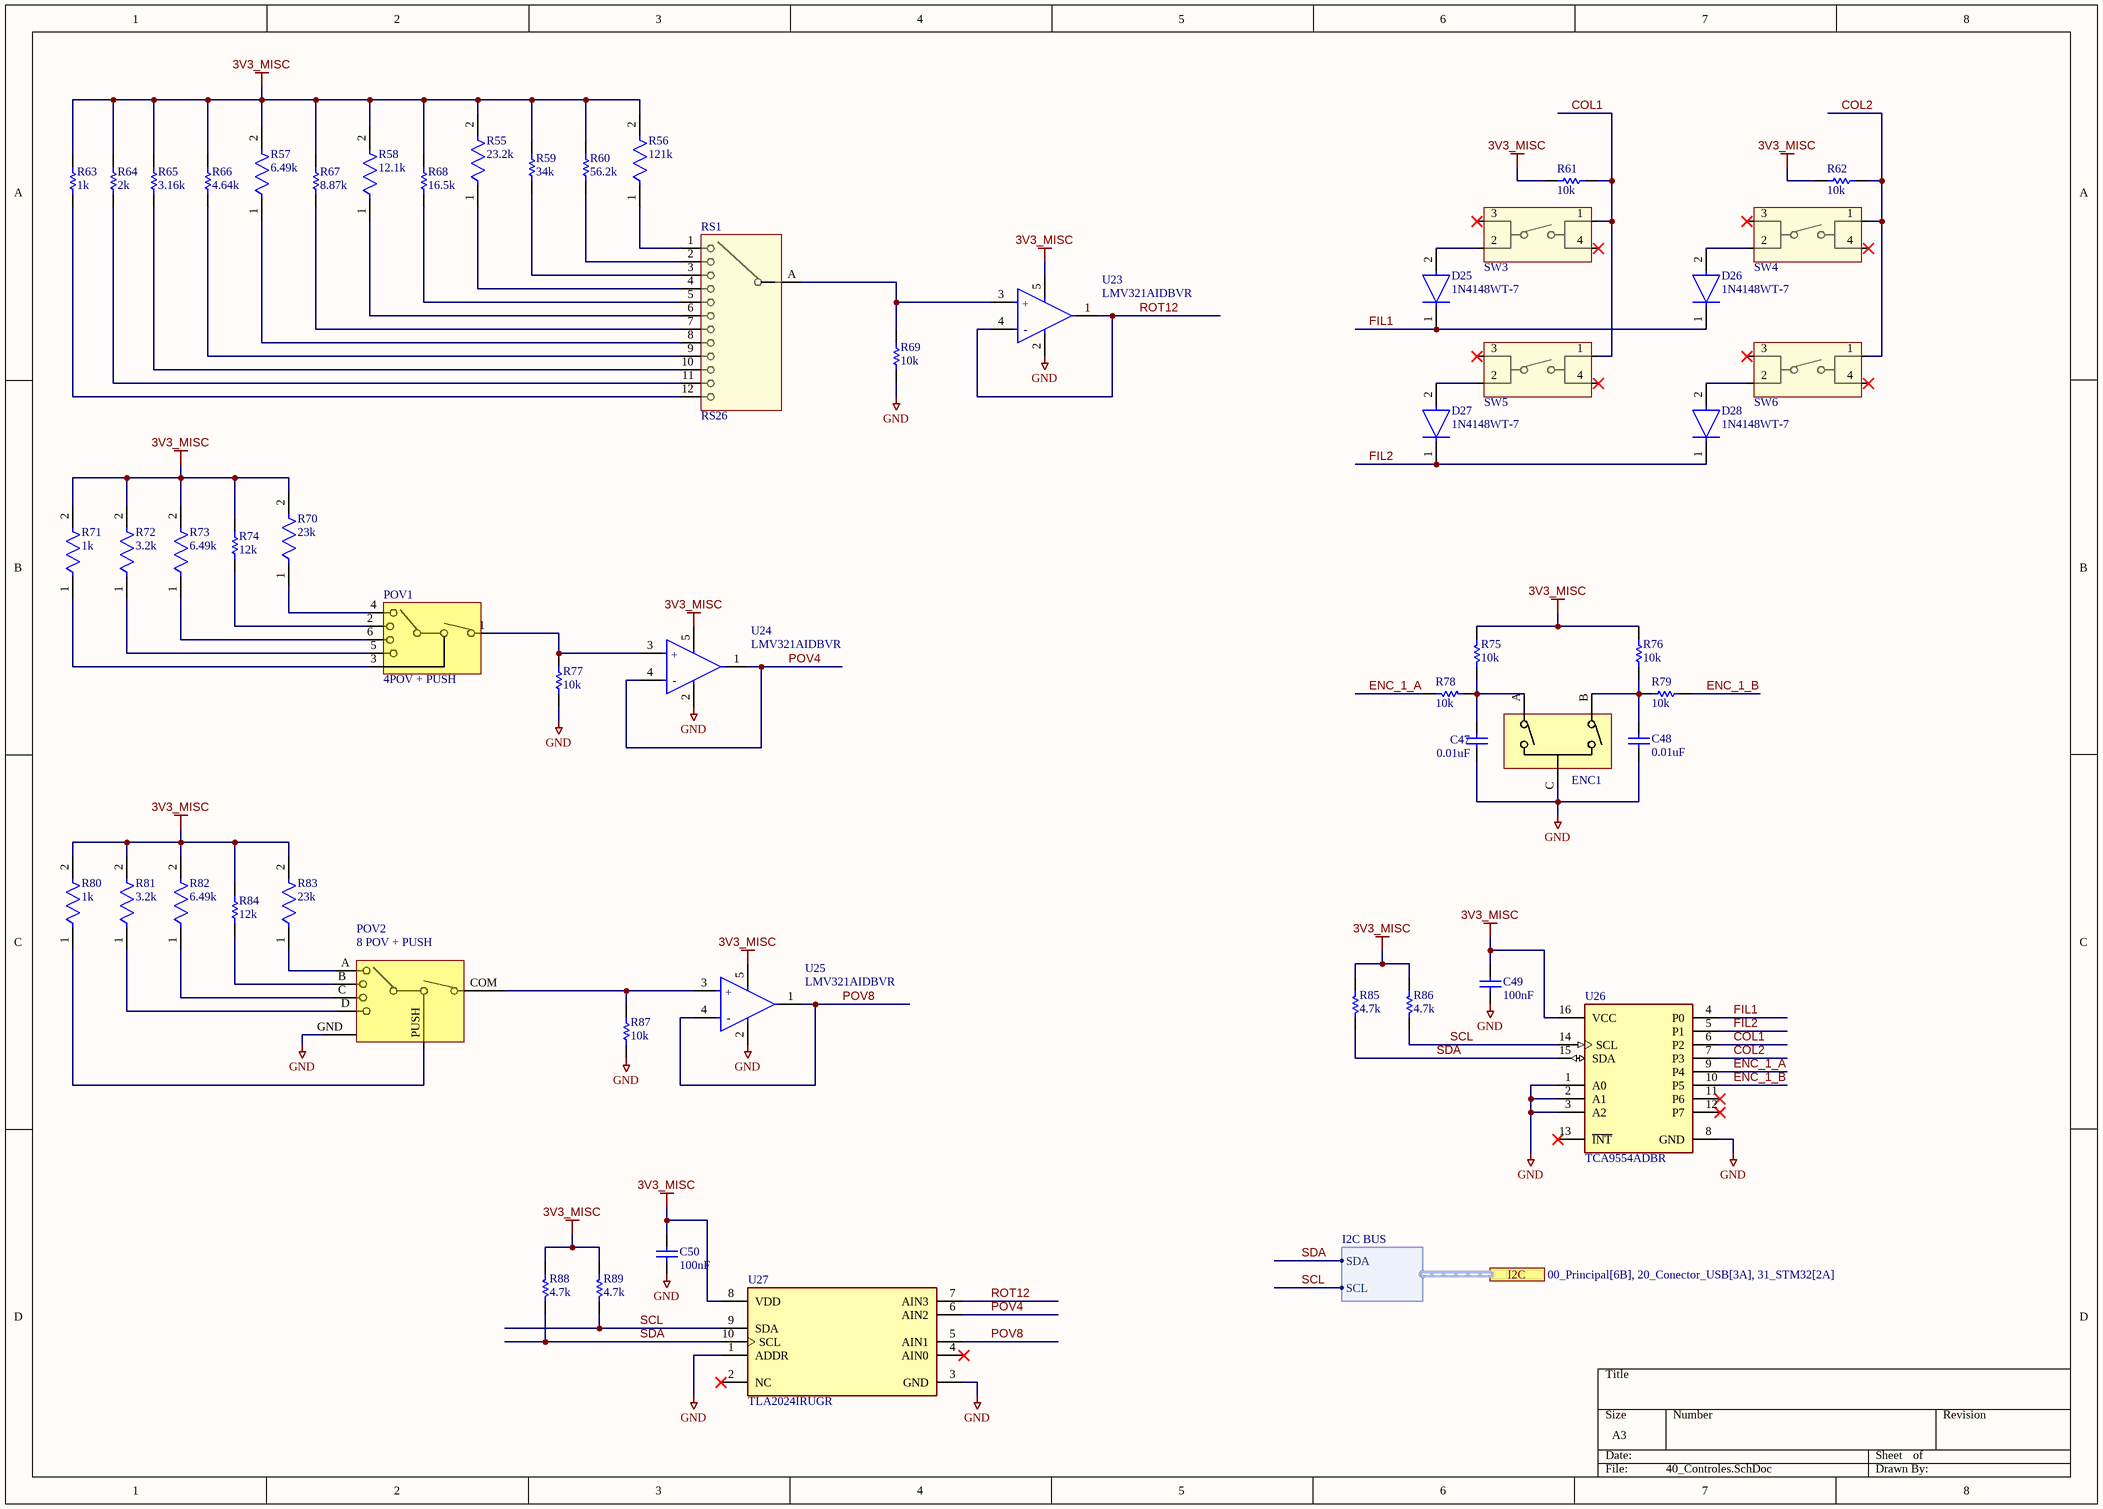
[diagram p10: 40_Controles.SchDoc]

### Parts
C47  0.01uF  [CAPC1005X55X25LL05T10]
C48  0.01uF  [CAPC1005X55X25LL05T10]
C49  100nF  [CAPC1005X55X25NL05T05]
C50  100nF  [CAPC1005X55X25NL05T05]
D25  1N4148WT-7  [FP-SOD523-MFG]
D26  1N4148WT-7  [FP-SOD523-MFG]
D27  1N4148WT-7  [FP-SOD523-MFG]
D28  1N4148WT-7  [FP-SOD523-MFG]
ENC1  Encoder  [PEC09-2315F-N0015]  (value not drawn)
POV1  4POV + PUSH  [TSSJ 30]
POV2  8 POV + PUSH  [RKJXM1015004]
R55  23.2k  [FP-ERJ2R-MFG]
R56  121k  [FP-ERJ2R-MFG]
R57  6.49k  [FP-ERJ2RK-MFG]
R58  12.1k  [FP-ERJ2RK-IPC_C]
R59  34k  [RESC1005X40X25LL05T05]
R60  56.2k  [RESC1005X40X25LL05T05]
R61  10k  [RESC1005X40X25ML05T05]
R62  10k  [RESC1005X40X25ML05T05]
R63  1k  [RESC1005X40X25NL05T05]
R64  2k  [RESC1005X40X25LL10T10]
R65  3.16k  [RESC1005X40X25ML05T05]
R66  4.64k  [RESC1005X40X25LL05T05]
R67  8.87k  [RESC1005X40X25NL05T05]
R68  16.5k  [RESC1005X40X25LL05T05]
R69  10k  [RESC1005X40X25ML05T05]
R70  23k  [FP-AC0402-MFG]
R71  1k  [FP-MCS0402-IPC_B]
R72  3.2k  [FP-RN73R1E-IPC_A]
R73  6.49k  [FP-MCS0402-IPC_A]
R74  12k  [RESC0402(1005)_M]
R75  10k  [RESC1005X40X25ML05T05]
R76  10k  [RESC1005X40X25ML05T05]
R77  10k  [RESC1005X40X25ML05T05]
R78  10k  [RESC1005X40X25ML05T05]
R79  10k  [RESC1005X40X25ML05T05]
R80  1k  [FP-MCS0402-IPC_B]
R81  3.2k  [FP-RN73R1E-IPC_A]
R82  6.49k  [FP-MCS0402-IPC_A]
R83  23k  [FP-AC0402-MFG]
R84  12k  [RESC0402(1005)_M]
R85  4.7k  [RESC1005X40X25ML05T10]
R86  4.7k  [RESC1005X40X25ML05T10]
R87  10k  [RESC1005X40X25ML05T05]
R88  4.7k  [RESC1005X40X25ML05T10]
R89  4.7k  [RESC1005X40X25ML05T10]
RS1  RS26  [RS26]
SW3  KSC441G70SHLFSPF  [KSC441G 70SH LFS PF]  (value not drawn)
SW4  KSC441G70SHLFSPF  [KSC441G 70SH LFS PF]  (value not drawn)
SW5  KSC441G70SHLFSPF  [KSC441G 70SH LFS PF]  (value not drawn)
SW6  KSC441G70SHLFSPF  [KSC441G 70SH LFS PF]  (value not drawn)
U23  LMV321AIDBVR  [FP-DBV0005A-MFG]
U24  LMV321AIDBVR  [FP-DBV0005A-MFG]
U25  LMV321AIDBVR  [FP-DBV0005A-MFG]
U26  TCA9554ADBR  [FP-DB0016A-MFG]
U27  TLA2024IRUGR  [FP-RUG0010A-MFG]

### Ports
I2C (harness I2C BUS, see 00_Principal[6B], 20_Conector_USB[3A], 31_STM32[2A])

### Harnesses
I2C BUS: SDA, SCL

### Nets
3V3_MISC: C49.2 C50.2 R55.2 R56.2 R57.2 R58.2 R59.2 R60.2 R61.2 R62.2 R63.2 R64.2 R65.2 R66.2 R67.2 R68.2 R70.2 R71.2 R72.2 R73.2 R74.2 R75.1 R76.1 R80.2 R81.2 R82.2 R83.2 R84.2 R85.2 R86.2 R88.2 R89.2 U23.5(V+) U24.5(V+) U25.5(V+) U26.16(VCC) U27.8(VDD)
GND: C47.1 C48.1 C49.1 C50.1 ENC1.C(COM) POV2.GND R69.1 R77.1 R87.1 U23.2(V-) U24.2(V-) U25.2(V-) U26.1(A0) U26.2(A1) U26.3(A2) U26.8(GND) U27.1(ADDR) U27.3(GND)
COL1: R61.1 SW3.1 SW5.1 U26.6(P2)
COL2: R62.1 SW4.1 SW6.1 U26.7(P3)
ENC_1_A: R78.1 U26.9(P4)
ENC_1_B: R79.1 U26.10(P5)
FIL1: D25.1(C) D26.1(C) U26.4(P0)
FIL2: D27.1(C) D28.1(C) U26.5(P1)
POV4: U24.1(OUT) U24.4(-IN) U27.6(AIN2)
POV8: U25.1(OUT) U25.4(-IN) U27.5(AIN1)
ROT12: U23.1(OUT) U23.4(-IN) U27.7(AIN3)
SCL: R86.1 R89.1 U26.14(SCL) U27.9(SDA) ; port I2C.SCL
SDA: R85.1 R88.1 U26.15(SDA) U27.10(SCL) ; port I2C.SDA
NetC47_2: C47.2 ENC1.A(COM) R75.2 R78.2
NetC48_2: C48.2 ENC1.B(COM) R76.2 R79.2
NetD25_2: D25.2(A) SW3.2
NetD26_2: D26.2(A) SW4.2
NetD27_2: D27.2(A) SW5.2
NetD28_2: D28.2(A) SW6.2
NetPOV1_1: POV1.1(COM) R77.2 U24.3(+IN)
NetPOV1_2: POV1.2(DIRB) R74.1
NetPOV1_3: POV1.3 R71.1
NetPOV1_4: POV1.4(DIRA) R70.1
NetPOV1_5: POV1.5(DIRD) R72.1
NetPOV1_6: POV1.6(DIRC) R73.1
NetPOV2_A: POV2.A(DIRA) R83.1
NetPOV2_B: POV2.B(DIRB) R84.1
NetPOV2_C: POV2.C(DIRC) R82.1
NetPOV2_COM: POV2.COM R87.2 U25.3(+IN)
NetPOV2_D: POV2.D(DIRD) R81.1
NetPOV2_PUSH: POV2.PUSH R80.1
NetR55_1: R55.1 RS1.4(A)
NetR56_1: R56.1 RS1.1(A)
NetR57_1: R57.1 RS1.8(A)
NetR58_1: R58.1 RS1.6(A)
NetR59_1: R59.1 RS1.3(A)
NetR60_1: R60.1 RS1.2(A)
NetR63_1: R63.1 RS1.12(A)
NetR64_1: R64.1 RS1.11(A)
NetR65_1: R65.1 RS1.10(A)
NetR66_1: R66.1 RS1.9(A)
NetR67_1: R67.1 RS1.7(A)
NetR68_1: R68.1 RS1.5(A)
NetR69_2: R69.2 RS1.A U23.3(+IN)

Not connected (* = marked no-connect by the designer): SW3 3(2)* 4(3)*; SW4 3(2)* 4(3)*; SW5 3(2)* 4(3)*; SW6 3(2)* 4(3)*; U26 11(P6)* 12(P7)* 13(~{INT})*; U27 2(NC)* 4(AIN0)*

### Notes on the sheet
- (in symbol CMP-04895-000333-1) +; -

### Library data of the parts
C47 C48 = CMP-1034-01880-2: Manufacturer: Murata; Part Number: GRM155R71E103KA01D
C49 C50 = CMP-2008-02030-1: Manufacturer: Vitramon; Part Number: VJ0402Y104KXJCW1BC
D25-D28 = CMP-2000-05518-3: DIODE GEN PURP 80V 125MA SOD523; Power Rating: 150mW; Peak Non-Repetitive Surge Current: 2A; Forward Voltage: 1.25V; Reverse Recovery Time: 4ns; Peak Reverse Current: 1uA; Max Repetitive Reverse Voltage (Vrrm): 100V; Capacitance: 2pF; Polarity: Standard; Element Configuration: Single; Forward Current: 250mA; Lead Free: Lead Free; Packaging: Tape and Reel; Length: 0.9mm; Min Operating Temperature: -65°C; Current Rating: 125mA; Max Reverse Voltage (DC): 80V; Width: 1.3mm; Package Quantity: 3000; Output Current: 125mA; Power Dissipation: 150mW; Max Operating Temperature: 150°C; Radiation Hardening: No; Average Rectified Current: 125mA; Height: 0.65mm; Voltage Rating (DC): 80V; Max Surge Current: 2A; Weight: 3.5E-05oz; Recovery Time: 4ns; Max Forward Surge Current (Ifsm): 2A; Contact Plating: Tin; Number of Pins: 2; Mount: Surface Mount; REACH SVHC: No SVHC
ENC1 = PEC09-2315F-N0015: PEC09 PC Pin Quadrature (Incremental) 12 Mechanical Encoder 11.4mm 70C; Manufacturer: Bourns; Built in Switch: No; Detent: Yes; Number of Circuits: 1; Output Type: Incremental, Quadrature; Pulses per Revolution: 12; Supplier: DigiKey; Supplier Part Number: 118-PEC09-2315F-N0015-ND; Manufacturer Part Number: PEC09-2315F-N0015; RoHS: Compliant; Category: Encoders; Stock: 1221; Pricing: 1=2.47, 10=2.078, 25=1.9392, 50=1.8398, 100=1.745, 300=1.60387, 500=1.54196, 1000=1.46156, 5000=1.29003 (USD); Country of Origin: Taiwan; Encoder Type: Mechanical; Introduction Date: 2010-10-15; Lifecycle Status: Production; Max Operating Temperature: 70°C; Min Operating Temperature: -10°C; Mounting Technology: PCB, Panel, Through Hole; Orientation: Right Angle; REACH SVHC: Yes; Schedule B: 8543709655; Termination: PC Pin; Width: 9.7mm; ComponentLink1URL: https://datasheet.octopart.com:443/PEC09-2315F-N0015-Bourns-datasheet-179971531.pdf?src-supplier=IHS; ComponentLink1Description: https://datasheet.octopart.com:443/PEC09-2315F-N0015-Bourns-datasheet-179971531.pdf?src-supplier=IHS; ComponentLink2URL: https://datasheet.octopart.com:443/PEC09-2315F-N0015-Bourns-datasheet-67810299.pdf?src-supplier=JRH+Electronics; ComponentLink2Description: https://datasheet.octopart.com:443/PEC09-2315F-N0015-Bourns-datasheet-67810299.pdf?src-supplier=JRH+Electronics; ComponentLink3URL: https://datasheet.octopart.com:443/PEC09-2315F-N0015-Bourns-datasheet-177040331.pdf?src-supplier=Burklin+Elektronik; ComponentLink3Description: https://datasheet.octopart.com:443/PEC09-2315F-N0015-Bourns-datasheet-177040331.pdf?src-supplier=Burklin+Elektronik; ComponentLink4URL: https://datasheet.octopart.com/PEC09-2315F-N0015-Bourns-datasheet-10938969.pdf; ComponentLink4Description: https://datasheet.octopart.com/PEC09-2315F-N0015-Bourns-datasheet-10938969.pdf; ComponentLink5URL: http://sigma.octopart.com:80/conflict_mineral_statement/Bourns-company-36.pdf?src-supplier=Compliance+Statements; ComponentLink5Description: http://sigma.octopart.com:80/conflict_mineral_statement/Bourns-company-36.pdf?src-supplier=Compliance+Statements
POV1 = TSSJ 30: SWITCH NAVIGATION 20MA 15V
POV2 = RKJXM1015004: 8-directional Stick Switch (with Center-push Function) RKJXM Series
R55 = CMP-1011-00662-3: RES SMD 23.2K OHM 1% 1/10W 0402; Manufacturer Part Number: ERJ-2RKF2322X; Manufacturer: Panasonic; Voltage Rating: 50V; Power Rating: 0.1W; Resistance: 23.2kΩ; Temperature Coefficient: 100%; Automotive Grade: Grade 0; Value: 23.2kΩ; Package: ERJ2R; Device Class L2: Resistors; Height: 0.4mm; Temperature Range High: +155°C; Device Class L1: Passive Components; Temperature Range Low: -55°C; Device Class L3: Chip SMD Resistors; ComponentLink2Description: Datasheet; Temperature: -55°C to +155°C; Footprint Url: https://industrial.panasonic.com/cdbs/www-data/pdf/RDA0000/DMA0000COL17.pdf; Category: Res; Automotive: Yes; ComponentLink2URL: https://industrial.panasonic.com/cdbs/www-data/pdf/RDA0000/AOA0000C304.pdf; Digikey Description: RES SMD 23.2K OHM 1% 1/10W 0402; Ipc Land Pattern Name: RESC10050X35; Tolerance: 1%; Lead Free: Yes; RoHS: TRUE; Octopart: https://octopart.com/erj-2rkf2322x-panasonic-55421023; Mouser Description: Thick Film Resistors - SMD 0402 23.2Kohms 1% AEC-Q200; Series: ERJ; Composition: Thick Film
R56 = CMP-2002-00650-2: RES SMD 121K OHM 1% 1/10W 0402; Manufacturer: Panasonic; Manufacturer Part Number: ERJ-2RKF1213X; Voltage Rating: 50V; Power Rating: 0.1W; Value: 121kΩ; Automotive Grade: Grade 0; Temperature Coefficient: 100ppm/°C; Temperature: -55°C to +155°C; Footprint Url: https://industrial.panasonic.com/cdbs/www-data/pdf/RDA0000/DMA0000COL17.pdf; RoHS: TRUE; Ipc Land Pattern Name: RESC10050X35; Automotive: Yes; ComponentLink2Description: Datasheet; Temperature Range Low: -55°C; Octopart: https://octopart.com/erj-2rkf1213x-panasonic-55420883; Category: Res; Package: ERJ2R; Mouser Description: Thick Film Resistors - SMD 0402 121Kohms 1% Tol; Device Class L2: Resistors; Device Class L3: Chip SMD Resistors; Height: 0.4mm; Device Class L1: Passive Components; Tolerance: 1%; Series: ERJ; Digikey Description: RES SMD 121K OHM 1% 1/10W 0402; Temperature Range High: +155°C; Lead Free: Yes; Composition: Thick Film; ComponentLink2URL: https://industrial.panasonic.com/cdbs/www-data/pdf/RDA0000/AOA0000C304.pdf; Resistance: 121kΩ
R57 = CMP-2002-01028-2: NexarPartId: 55421257; Max Power Dissipation: 100mW; Resistance: 6.49kΩ; Voltage Rating: 50V; Tolerance: 1%; Temperature Coefficient: 100ppm/°C; RoHS: Compliant; Number of Terminations: 2; Case Code (Metric): 1005; Schedule B: 8533210045, 8533210045; Composition: Thick Film; Lead Free: Lead Free; Length: 1mm; Voltage Rating (DC): 50V; Max Operating Temperature: 155°C; Width: 508µm; Case Code (Imperial): 0402; REACH SVHC: No SVHC; Depth: 500µm; Contact Plating: Tin; Power Rating: 100mW; Military Standard: Not; Termination: SMD/SMT; Case/Package: 0402; Min Operating Temperature: -55°C; Packaging: Cut Tape; Height: 406.4µm; Lifecycle Status: Production; Mount: Surface Mount
R58 = CMP-2002-00649-2: RES SMD 12.1K OHM 1% 1/10W 0402; Voltage Rating (DC): 50V; Power Rating: 100mW; Temperature Coefficient: 100ppm/°C; Resistance: 12.1kR; Width: 0.02inch; Military Standard: Not; Resistance Tolerance: 1%; Resistor Type: Thick Film; Voltage Rating: 50V; Case/Package: 0402; Packaging: Tape and Reel; Series: ERJ; Number of Terminations: 2; Case Code (Metric): 1005; Radiation Hardening: No; Min Operating Temperature: -55°C; Construction: Rectangular; Technology: THICK FILM; RoHS Compliant: Yes; Termination: SMD/SMT; Contact Plating: Tin; Max Operating Temperature: 155°C; Max Power Dissipation: 100mW; Tolerance: 1%; Features: Automotive AEC-Q200; Height: 0.35mm; REACH SVHC: No SVHC; Depth: 0.5mm; Case Code (Imperial): 0402; Lead Free: Lead Free; Length: 1mm; Mount: Surface Mount; Package Quantity: 1
R59 = CMP-1011-00682-2: Part Number: ERJ-2RKF3402X; Manufacturer: Panasonic
R60 = CMP-2002-00996-1: Part Number: ERJ-2RKF5622X; Manufacturer: Panasonic
R61 R62 R69 R75-R79 R87 = CMP-2002-00601-1: Manufacturer: Panasonic; Part Number: ERJ-2RHD1002X
R63 = CMP-1011-00510-4: Chip Resistor, 1 KOhm, +/- 1%, 100 mW, -55 to 155 degC, 0402 (1005 Metric), RoHS, Tape and Reel; PartNumber: ERJ-2RKF1001X; Manufacturer: Basic Passives; Voltage Rating: 50 V; Case\/Package: 0402; Resistance: 1 KOhm; Power Rating: 100 mW; DatasheetVersion: 04/2015; Radiation Hardening: No; Pins: 2; Height: 0.35 mm; RoHSCompliant: true; Case Code (Imperial): 0402; ComponentLink2Description: Datasheet; ComponentLink1Description: Manufacturer URL; PackageReference: 0402; Mount: Surface Mount; Package Quantity: 10000; Tolerance: 1%; ComponentLink1URL: http://www.panasonic.com/; PackageDescription: 2-Pin Surface Mount Device, Body 1 x 0.5 mm; Mounting Technology: Surface Mount; Case Code (Metric): 1005; ComponentLink2URL: http://industrial.panasonic.com/cdbs/www-data/pdf/RDA0000/AOA0000C86.pdf; REACH SVHC: Yes; Packaging: Tape and Reel; Max Operating Temperature: 155 degC; Min Operating Temperature: -55 degC; Width: 0.5 mm; Length: 1 mm
R64 = CMP-2002-05790-1: Manufacturer: Panasonic; Part Number: ERA-2AEB202X
R65 = CMP-2002-00861-1: Manufacturer: Panasonic; Part Number: ERJ-2RKF3161X
R66 = CMP-2002-00951-1: Part Number: ERJ-2RKF4641X; Manufacturer: Panasonic
R67 = CMP-1011-00617-2: Part Number: ERJ-2RKF8871X; Manufacturer: Panasonic
R68 = CMP-2002-00717-1: Part Number: ERJ-2RKF1652X; Manufacturer: Panasonic
R70 R83 = CMP-03412-015848-2: RES 23.2kΩ ±1% 0.063W 0402; Resistance: 23.2kR; Max Power Dissipation: 63mW; Temperature Coefficient: 100ppm/°C; Features: Moisture Resistant; Military Standard: Not; Max Operating Temperature: 155°C; RoHS Compliant: Yes; Resistor Type: Thick Film; Min Operating Temperature: -55°C; Length: 0.039inch; Height: 0.015inch; Number of Terminations: 2; Width: 0.02inch; Series: AC; Depth: 0.5mm; Tolerance: 1%; Packaging: Tape and Reel; Case/Package: 0402
R71 R80 = CMP-2002-02445-2: RES SMD 1.2K OHM 1% 1/10W 0402; Resistance: 1kR; Tolerance: 0.1%; Max Power Dissipation: 63mW; Temperature Coefficient: 25ppm/°C; Max Operating Temperature: 125°C; Min Operating Temperature: -55°C; Case/Package: 0402; Packaging: Tape and Reel; Width: 0.02inch; Lead Free: Lead Free; Number of Terminations: 2; Height: 0.015inch; Package Quantity: 10000; Length: 0.039inch; Composition: Thin Film; Contact Plating: Tin; Depth: 0.5mm; Military Standard: Not
R72 R81 = CMP-04015-034609-1: 3.2kΩ ±0.1% 0.063W, 1/16W Chip Resistor 0402 (1005 Metric) Moisture Resistant Thin Film
R73 R82 = CMP-02407-008176-1: RES SMD 1.2K OHM 1% 1/10W 0402; Temperature Coefficient: 50ppm/°C; Resistance: 6.49kR; Max Power Dissipation: 100mW; Packaging: Tape and Reel; Lead Free: Lead Free; Tolerance: 1%; Case/Package: 0402; Length: 0.039inch; Height: 0.015inch; Package Quantity: 10000; Depth: 0.5mm; Composition: Thin Film; Width: 0.02inch; Min Operating Temperature: -55°C; Number of Terminations: 2; Military Standard: Not; Max Operating Temperature: 155°C
R74 R84 = CMP-1011-00100-1: 12K 0.063W 5% 0402 (1005 Metric)  SMD; Case-Metric: 1005; Value: 12000.00 Ohm; Case-EIA: 0402; Technology: SMT; Tolerance: 5 %; Power: 0.063 W
R85 R86 R88 R89 = CMP-2002-06456-1: Manufacturer: Panasonic; Part Number: ERJ-S02F4701X
RS1 = RS26 Rotary Coder: RS26 Rotary Type Band Switch Position Switch
SW3-SW6 = KSC441G70SHLFSPF: Switch Tactile N.O. SPST Button 1VA 32VDC 50mA 4N Gull Wing SMD T/R; Manufacturer: C&K Components; Supplier: DigiKey; Supplier Part Number: CKN11980CT-ND; Manufacturer Part Number: KSC441G70SHLFSPF; RoHS: Compliant; Category: Tactile Switches; Stock: 1; Pricing: 1=1.04, 10=0.887, 25=0.8248, 100=0.7353, 250=0.6812, 500=0.64368 (USD); Contact Current Rating: 50mA; Operating Force: 4N; ComponentLink1URL: https://datasheet.octopart.com:443/KSC441G70SHLFSPF-C%26K-Components-datasheet-128529453.pdf?src-supplier=Electro+Sonic; ComponentLink1Description: https://datasheet.octopart.com:443/KSC441G70SHLFSPF-C%26K-Components-datasheet-128529453.pdf?src-supplier=Electro+Sonic; ComponentLink2URL: https://datasheet.octopart.com:443/KSC441G70SHLFSPF-C%26K-Components-datasheet-100062959.pdf?src-supplier=Future+Electronics; ComponentLink2Description: https://datasheet.octopart.com:443/KSC441G70SHLFSPF-C%26K-Components-datasheet-100062959.pdf?src-supplier=Future+Electronics; Supplier 1: DigiKey; Supplier Part Number 1: CKN11980CT-ND
U23-U25 = CMP-04895-000333-1: IC OPAMP GP 1 CIRCUIT SOT23-5; Input Bias Current: 10pA; Output Current per Channel: 40mA; Gain Bandwidth Product: 1MHz; Input Offset Voltage (Vos): 1mV; Number of Channels: 1; Operating Supply Current: 80uA; Slew Rate: 1.7V/µs; Mount: Surface Mount; Min Operating Temperature: -40°C; Packaging: Cut Tape; Case/Package: SOT-23-5; RoHS Compliant: Yes; Max Operating Temperature: 125°C; Number of Circuits: 1
U26 = CMP-04886-000016-1: IC SMBUS I/O EXPANDER I2C 16SSOP; Min Supply Voltage: 1.65V; Max Supply Voltage: 5.5V; Frequency: 400kHz; Number of I/Os: 8; Output Type: PUSH-PULL; Lead Free: Lead Free; RoHS Compliant: Yes; Packaging: Cut Tape; Series: -; Max Operating Temperature: 85°C; Min Operating Temperature: -40°C; Interface: I2C; Mount: Surface Mount; Case/Package: SSOP; Number of Pins: 16; REACH SVHC: No SVHC
U27 = CMP-04860-000013-1: IC ADC 12BIT SIGMA-DELTA 10X2QFN; Number of A/D Converters: 1; Interface: I2C; Number of Bits: 12; Sampling Rate: 3300S/s; Number of Inputs: 4; Mount: Surface Mount; Max Operating Temperature: 85°C; Min Operating Temperature: -40°C; RoHS Compliant: Yes; Packaging: Tape and Reel

## Nets that join several sheets
3V3_MISC: 20_Conector_USB (R32.2 R33.2), 50_Gestión_Alimentación (C46.1 R54.2 TP7.1 U22.5), 40_Controles (37 pins)
5V: 21_HUB (C6.1 R22.2 U11.1 U11.3), 50_Gestión_Alimentación (R47.2 TP4.1 U18.2 U18.7), 31_STM32 (F2.1 J10.2), 30_ATMega32u4 (F1.1), 33_USB_VoCore (C2.2 R20.2 U3.1)
5V_DBG: 31_1_Conector_USB (FB4.2 R90.2 TP8.1), 50_Gestión_Alimentación (R53.1 U17.3 U21.6)
5V_LRS: 10_Alimentacion_Externa (R2.2 U1.6), 50_Gestión_Alimentación (R42.1 U18.3 U18.5), 41_LEDs (6 pins)
5V_MAIN: 20_Conector_USB (FB3.2 R34.2 R36.1 TP2.1), 50_Gestión_Alimentación (5 pins)
5V_MISC: 20_Conector_USB (C4.2 U4.12), 50_Gestión_Alimentación (13 pins)
GND: 00_Principal (8 pins), 10_Alimentacion_Externa (15 pins), 20_Conector_USB (16 pins), 21_HUB (38 pins), 31_1_Conector_USB (11 pins), 50_Gestión_Alimentación (18 pins), 31_STM32 (17 pins), 30_ATMega32u4 (15 pins), 33_USB_VoCore (15 pins), 41_LEDs (12 pins), 40_Controles (18 pins)
AT_2020: 30_ATMega32u4 (U13.27), 41_LEDs (U8.1)
AT_5050: 30_ATMega32u4 (U13.26), 41_LEDs (U7.1)
CC1_DEBUG: 31_1_Conector_USB (D31.1 J8.A5), 50_Gestión_Alimentación (U20.1)
CC2_DEBUG: 31_1_Conector_USB (D32.1 J8.B5), 50_Gestión_Alimentación (U20.2)
DEBUG ON: 50_Gestión_Alimentación (TP5.1 U17.4 U19.4), 31_STM32 (U16.9)
DEBUG_D_P: 31_1_Conector_USB (D33.1 J8.A6 J8.B6), 31_STM32 (U16.3)
HUB_RESET: 21_HUB (R17.1 U5.18), 31_STM32 (U14.8)
IMON: 10_Alimentacion_Externa (R8.2 U1.9), 31_STM32 (U14.10)
LRS PG: 10_Alimentacion_Externa (R4.1 U1.3 U2.3), 31_STM32 (U14.6)
SCL: 20_Conector_USB (R32.1 U4.8), 21_HUB (U9.2), 31_STM32 (J11.2 R27.1 U14.1), 40_Controles (R86.1 R89.1 U26.14 U27.9)
SDA: 20_Conector_USB (R33.1 U4.7), 21_HUB (U9.4), 31_STM32 (R26.1 U14.2), 40_Controles (R85.1 R88.1 U26.15 U27.10)
ST_2020: 31_STM32 (U14.15), 41_LEDs (U8.3)
ST_5050: 31_STM32 (U14.14), 41_LEDs (U7.3)
ST_PA1: 21_HUB (R39.1 U10.7), 31_STM32 (U14.7)
ST_PA3: 21_HUB (U9.7 U9.8), 31_STM32 (U14.9)
ST_PA5: 31_STM32 (U14.11), 41_LEDs (U7.6 U8.6)
ST_PA6: 31_STM32 (U14.12), 33_USB_VoCore (R31.2 U3.3)
ST_PA7: 31_STM32 (U14.13), 33_USB_VoCore (R20.1 U3.4)
STMHUB_D_P: 21_HUB (U5.42), 31_STM32 (U16.1)
USBD_ATMega_N: 21_HUB (U5.50), 30_ATMega32u4 (R29.1)
USBD_ATMega_P: 21_HUB (U5.49), 30_ATMega32u4 (R28.1)
USBD_HUB_N: 20_Conector_USB (D18.1 J3.A7 J3.B7), 21_HUB (U5.21)
USBD_HUB_P: 20_Conector_USB (D17.1 J3.A6 J3.B6), 21_HUB (U5.22)
USBD_VoCore_N: 21_HUB (U5.56), 33_USB_VoCore (D5.1 J1.A7 J1.B7)
USBD_VoCore_P: 21_HUB (U5.57), 33_USB_VoCore (D4.1 J1.A6 J1.B6)